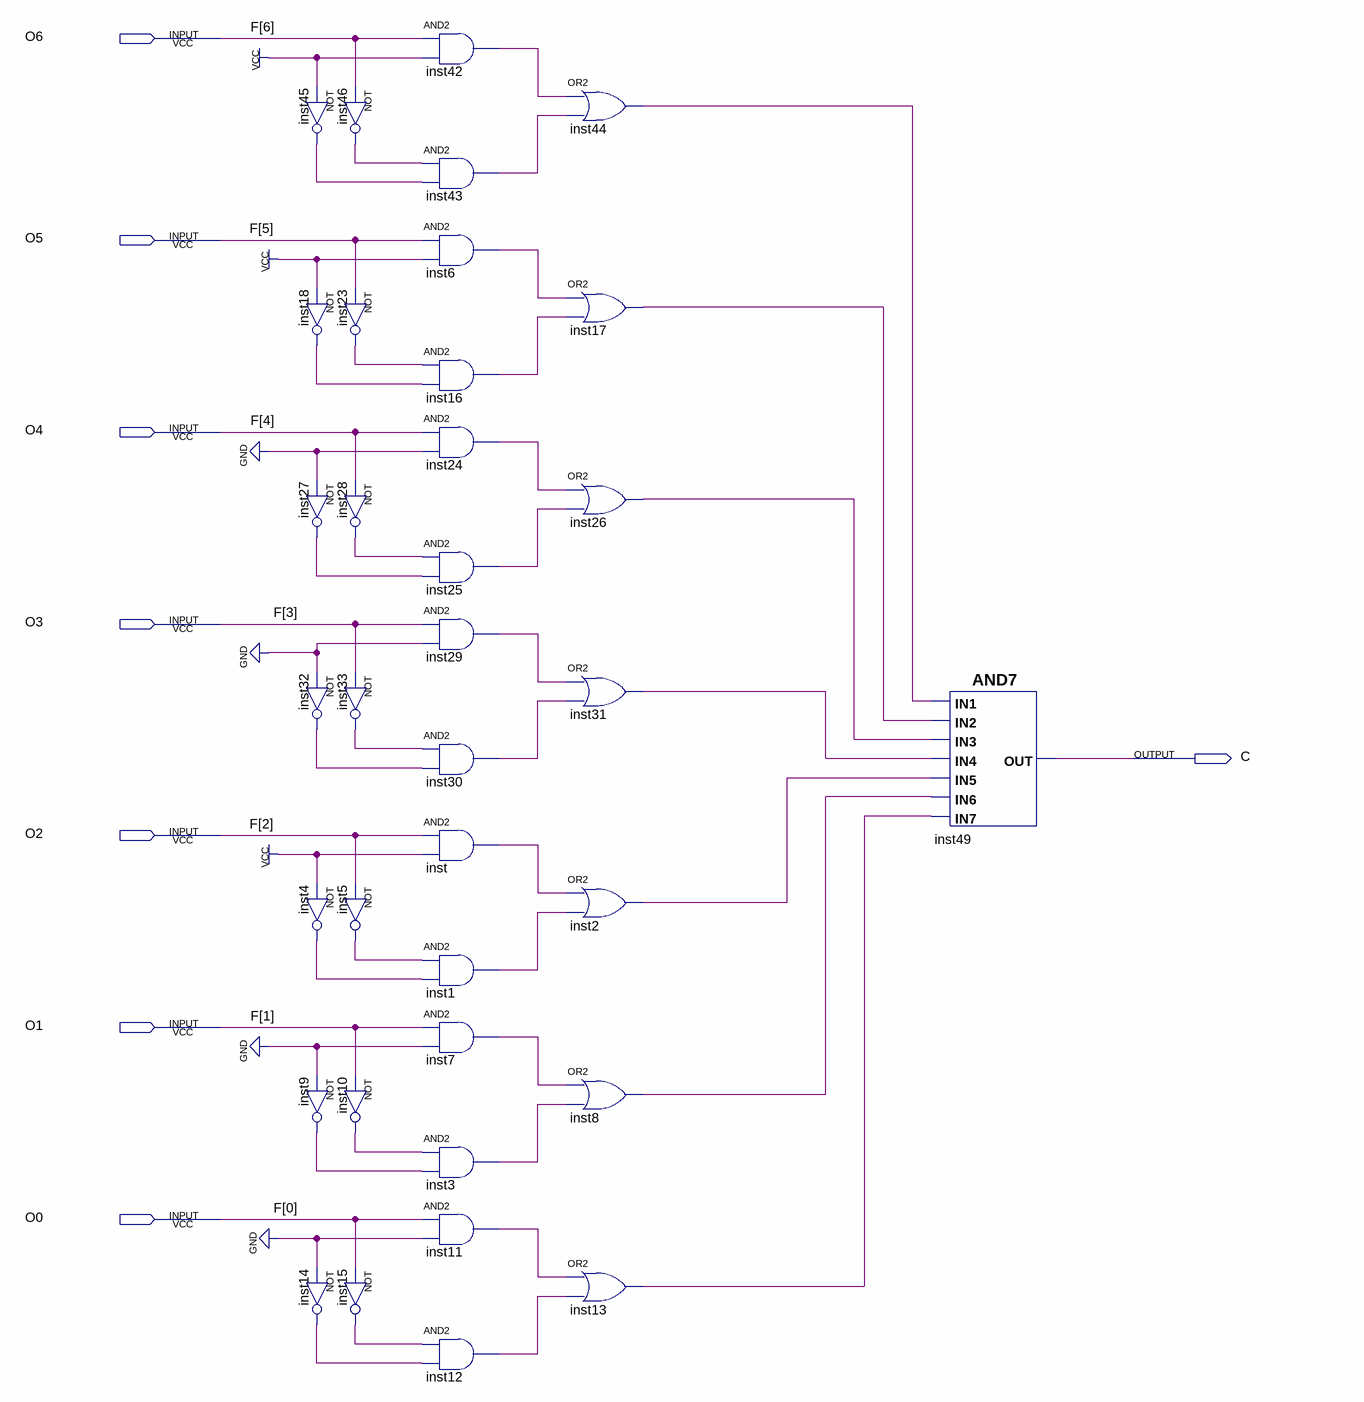
[diagram p0: schematic sheet]
// Quartus schematic CMP.bdf as structural Verilog: 36 symbols, 8 pins
module CMP (
  input  O6,
  input  O5,
  input  O4,
  input  O3,
  input  O2,
  input  O1,
  input  O0,
  output C
);

  wire inst1_out, inst2_out, inst3_out, inst4_out, inst5_out, inst6_out, inst7_out, inst8_out, inst9_out,
       inst10_out, inst11_out, inst12_out, inst13_out, inst14_out, inst15_out, inst16_out, inst17_out,
       inst18_out, inst23_out, inst24_out, inst25_out, inst26_out, inst27_out, inst28_out, inst29_out,
       inst30_out, inst31_out, inst32_out, inst33_out, inst42_out, inst43_out, inst44_out, inst45_out,
       inst46_out, inst_out;

  not inst45 (inst45_out, 1'b1);
  not inst46 (inst46_out, O6);
  not inst18 (inst18_out, 1'b1);
  not inst23 (inst23_out, O5);
  not inst27 (inst27_out, 1'b0);
  not inst28 (inst28_out, O4);
  not inst32 (inst32_out, 1'b0);
  not inst33 (inst33_out, O3);
  not inst4 (inst4_out, 1'b1);
  not inst5 (inst5_out, O2);
  not inst9 (inst9_out, 1'b0);
  not inst10 (inst10_out, O1);
  not inst14 (inst14_out, 1'b0);
  not inst15 (inst15_out, O0);
  and inst42 (inst42_out, O6, 1'b1);
  and inst43 (inst43_out, inst46_out, inst45_out);
  and inst6 (inst6_out, O5, 1'b1);
  and inst16 (inst16_out, inst23_out, inst18_out);
  and inst24 (inst24_out, O4, 1'b0);
  and inst25 (inst25_out, inst28_out, inst27_out);
  and inst29 (inst29_out, O3, 1'b0);
  and inst30 (inst30_out, inst33_out, inst32_out);
  and inst (inst_out, O2, 1'b1);
  and inst1 (inst1_out, inst5_out, inst4_out);
  and inst7 (inst7_out, O1, 1'b0);
  and inst3 (inst3_out, inst10_out, inst9_out);
  and inst11 (inst11_out, O0, 1'b0);
  and inst12 (inst12_out, inst15_out, inst14_out);
  or inst44 (inst44_out, inst42_out, inst43_out);
  or inst17 (inst17_out, inst6_out, inst16_out);
  or inst26 (inst26_out, inst24_out, inst25_out);
  or inst31 (inst31_out, inst29_out, inst30_out);
  or inst2 (inst2_out, inst_out, inst1_out);
  or inst8 (inst8_out, inst7_out, inst3_out);
  or inst13 (inst13_out, inst11_out, inst12_out);
  and inst49 (C, inst44_out, inst17_out, inst26_out, inst31_out, inst2_out, inst8_out, inst13_out);

  // Other names for the same wires on the sheet: F[6:0] = {O6, O5, O4, O3, O2, O1, O0}
endmodule
